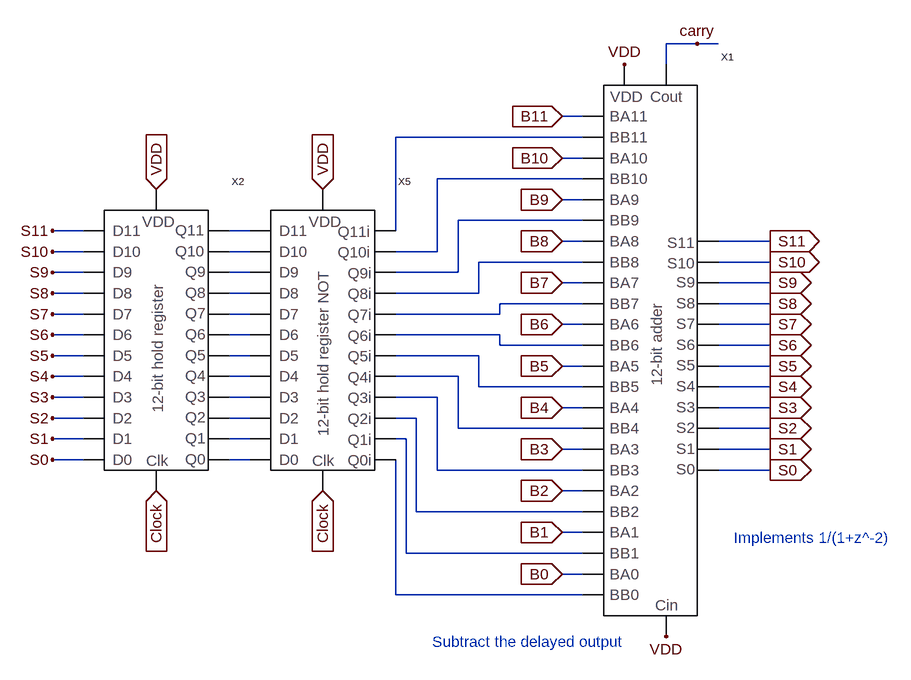
[diagram p0: schematic fsby4_resonator_12bit.asc]
fsby4_resonator_12bit.asc, the LTspice schematic file:
Version 4
SHEET 1 1324 932
WIRE 208 -1152 160 -1152
WIRE 240 -1152 208 -1152
WIRE 160 -1120 160 -1152
WIRE 32 -1040 0 -1040
WIRE 32 -1008 -256 -1008
WIRE 32 -976 0 -976
WIRE 32 -944 -192 -944
WIRE 32 -912 0 -912
WIRE 32 -880 -160 -880
WIRE -736 -864 -784 -864
WIRE -480 -864 -512 -864
WIRE -256 -864 -256 -1008
WIRE 32 -848 0 -848
WIRE 320 -848 240 -848
WIRE -736 -832 -784 -832
WIRE -480 -832 -512 -832
WIRE -192 -832 -192 -944
WIRE -192 -832 -256 -832
WIRE 32 -816 -128 -816
WIRE 320 -816 240 -816
WIRE -736 -800 -784 -800
WIRE -480 -800 -512 -800
WIRE -160 -800 -160 -880
WIRE -160 -800 -256 -800
WIRE 32 -784 0 -784
WIRE 320 -784 240 -784
WIRE -736 -768 -784 -768
WIRE -480 -768 -512 -768
WIRE -128 -768 -128 -816
WIRE -128 -768 -256 -768
WIRE 32 -752 -96 -752
WIRE 320 -752 240 -752
WIRE -736 -736 -784 -736
WIRE -480 -736 -512 -736
WIRE -96 -736 -96 -752
WIRE -96 -736 -256 -736
WIRE 32 -720 0 -720
WIRE 320 -720 240 -720
WIRE -736 -704 -784 -704
WIRE -480 -704 -512 -704
WIRE -96 -704 -256 -704
WIRE -96 -688 -96 -704
WIRE 32 -688 -96 -688
WIRE 320 -688 240 -688
WIRE -736 -672 -784 -672
WIRE -480 -672 -512 -672
WIRE -128 -672 -256 -672
WIRE 32 -656 0 -656
WIRE 320 -656 240 -656
WIRE -736 -640 -784 -640
WIRE -480 -640 -512 -640
WIRE -160 -640 -256 -640
WIRE -128 -624 -128 -672
WIRE 32 -624 -128 -624
WIRE 320 -624 240 -624
WIRE -736 -608 -784 -608
WIRE -480 -608 -512 -608
WIRE -192 -608 -256 -608
WIRE 32 -592 0 -592
WIRE 320 -592 240 -592
WIRE -736 -576 -784 -576
WIRE -480 -576 -512 -576
WIRE -224 -576 -256 -576
WIRE -160 -560 -160 -640
WIRE 32 -560 -160 -560
WIRE 320 -560 240 -560
WIRE -736 -544 -784 -544
WIRE -480 -544 -512 -544
WIRE -240 -544 -256 -544
WIRE 32 -528 0 -528
WIRE 320 -528 240 -528
WIRE -736 -512 -784 -512
WIRE -480 -512 -512 -512
WIRE -192 -496 -192 -608
WIRE 32 -496 -192 -496
WIRE 320 -496 240 -496
WIRE 32 -464 0 -464
WIRE -224 -432 -224 -576
WIRE 32 -432 -224 -432
WIRE 32 -400 0 -400
WIRE -240 -368 -240 -544
WIRE 32 -368 -240 -368
WIRE 32 -336 0 -336
WIRE -256 -304 -256 -512
WIRE 32 -304 -256 -304
FLAG 0 -1040 B11
IOPIN 0 -1040 In
FLAG 96 -1120 VDD
FLAG -624 -928 VDD
IOPIN -624 -928 In
FLAG -624 -464 Clock
IOPIN -624 -464 In
FLAG 320 -848 S11
IOPIN 320 -848 Out
FLAG 320 -816 S10
IOPIN 320 -816 Out
FLAG 320 -784 S9
IOPIN 320 -784 Out
FLAG 320 -752 S8
IOPIN 320 -752 Out
FLAG 320 -720 S7
IOPIN 320 -720 Out
FLAG 320 -688 S6
IOPIN 320 -688 Out
FLAG 320 -656 S5
IOPIN 320 -656 Out
FLAG 320 -624 S4
IOPIN 320 -624 Out
FLAG 320 -592 S3
IOPIN 320 -592 Out
FLAG 320 -560 S2
IOPIN 320 -560 Out
FLAG 320 -528 S1
IOPIN 320 -528 Out
FLAG 320 -496 S0
IOPIN 320 -496 Out
FLAG -784 -864 S11
FLAG -784 -832 S10
FLAG -784 -800 S9
FLAG -784 -768 S8
FLAG -784 -736 S7
FLAG -784 -704 S6
FLAG -784 -672 S5
FLAG -784 -640 S4
FLAG -784 -608 S3
FLAG -784 -576 S2
FLAG -784 -544 S1
FLAG -784 -512 S0
FLAG 208 -1152 carry
FLAG -368 -928 VDD
IOPIN -368 -928 In
FLAG -368 -464 Clock
IOPIN -368 -464 In
FLAG 160 -240 VDD
FLAG 0 -784 B7
IOPIN 0 -784 In
FLAG 0 -720 B6
IOPIN 0 -720 In
FLAG 0 -656 B5
IOPIN 0 -656 In
FLAG 0 -592 B4
IOPIN 0 -592 In
FLAG 0 -528 B3
IOPIN 0 -528 In
FLAG 0 -464 B2
IOPIN 0 -464 In
FLAG 0 -400 B1
IOPIN 0 -400 In
FLAG 0 -336 B0
IOPIN 0 -336 In
FLAG 0 -976 B10
IOPIN 0 -976 In
FLAG 0 -912 B9
IOPIN 0 -912 In
FLAG 0 -848 B8
IOPIN 0 -848 In
SYMBOL 12_bit_adder 64 -272 R0
SYMATTR InstName X1
SYMBOL 12_bit_register -704 -496 R0
SYMATTR InstName X2
SYMBOL 12_bit_register_NOT -448 -496 R0
SYMATTR InstName X5
TEXT 264 -392 Left 0 ;Implements 1/(1+z^-2)
TEXT -200 -232 Left 0 ;Subtract the delayed output

The netlist it stands for:
* fsby4_resonator_12bit.asc
XX1 VDD B0 N024 B1 N022 B2 N020 B3 N018 B4 N016 B5 N014 B6 N012 B7 N009 S0 carry VDD S1 S2 S3 S4 S5 S6 S7 S8 S9 S10 S11 B8 N006 B9 N003 B10 N002 B11 N001 12_bit_adder  ; pins VDD BA0 BB0 BA1 BB1 BA2 BB2 BA3 BB3 BA4 BB4 BA5 BB5 BA6 BB6 BA7 BB7 S0 Cout Cin S1 S2 S3 S4 S5 S6 S7 S8 S9 S10 S11 BA8 BB8 BA9 BB9 BA10 BB10 BA11 BB11
XX2 S0 S1 S2 S3 S4 S5 S6 S7 S8 S9 S10 S11 N023 N021 N019 N017 N015 N013 N011 N010 N008 N007 N005 N004 Clock VDD 12_bit_register  ; pins D0 D1 D2 D3 D4 D5 D6 D7 D8 D9 D10 D11 Q0 Q1 Q2 Q3 Q4 Q5 Q6 Q7 Q8 Q9 Q10 Q11 Clk VDD
XX5 N023 N021 N019 N017 N015 N013 N011 N010 N008 N007 N005 N004 N024 N022 N020 N018 N016 N014 N012 N009 N006 N003 N002 N001 Clock VDD 12_bit_register_NOT  ; pins D0 D1 D2 D3 D4 D5 D6 D7 D8 D9 D10 D11 Q0i Q1i Q2i Q3i Q4i Q5i Q6i Q7i Q8i Q9i Q10i Q11i Clk VDD
* Implements 1/(1+z^-2)
* Subtract the delayed output
.backanno
.end